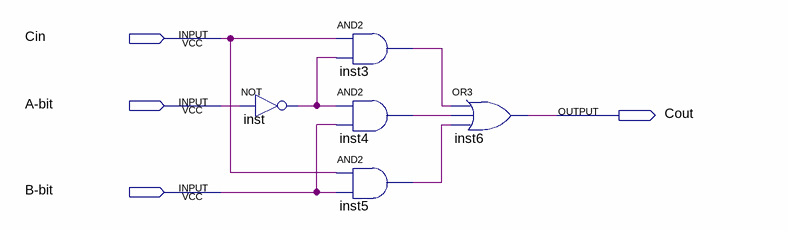
[diagram p0: schematic sheet]
// Quartus schematic comparadorBitSignif.bdf as structural Verilog: 5 symbols, 4 pins
module comparadorBitSignif (
  input  Cin,
  input  \A-bit ,
  input  \B-bit ,
  output Cout
);

  wire inst3_out, inst4_out, inst5_out, inst_out;

  not inst (inst_out, \A-bit );
  and inst3 (inst3_out, Cin, inst_out);
  and inst4 (inst4_out, inst_out, \B-bit );
  and inst5 (inst5_out, Cin, \B-bit );
  or inst6 (Cout, inst3_out, inst4_out, inst5_out);
endmodule
